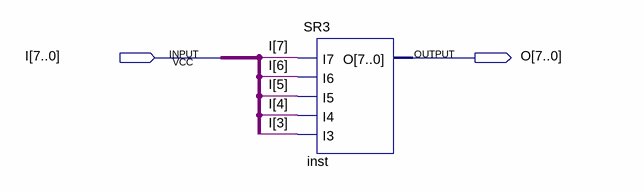
[diagram p0: schematic sheet]
// Quartus schematic 8ShiftRight3.bdf as structural Verilog: 1 symbols, 2 pins
module \8ShiftRight3  (
  input  [7:0] I,
  output [7:0] O
);

  SR3 inst (.I7(I[7]), .I6(I[6]), .I5(I[5]), .I4(I[4]), .I3(I[3]), .O(O));
endmodule
